# EAGLE design LM94022TmpBoard (EAGLE 6.5.0)
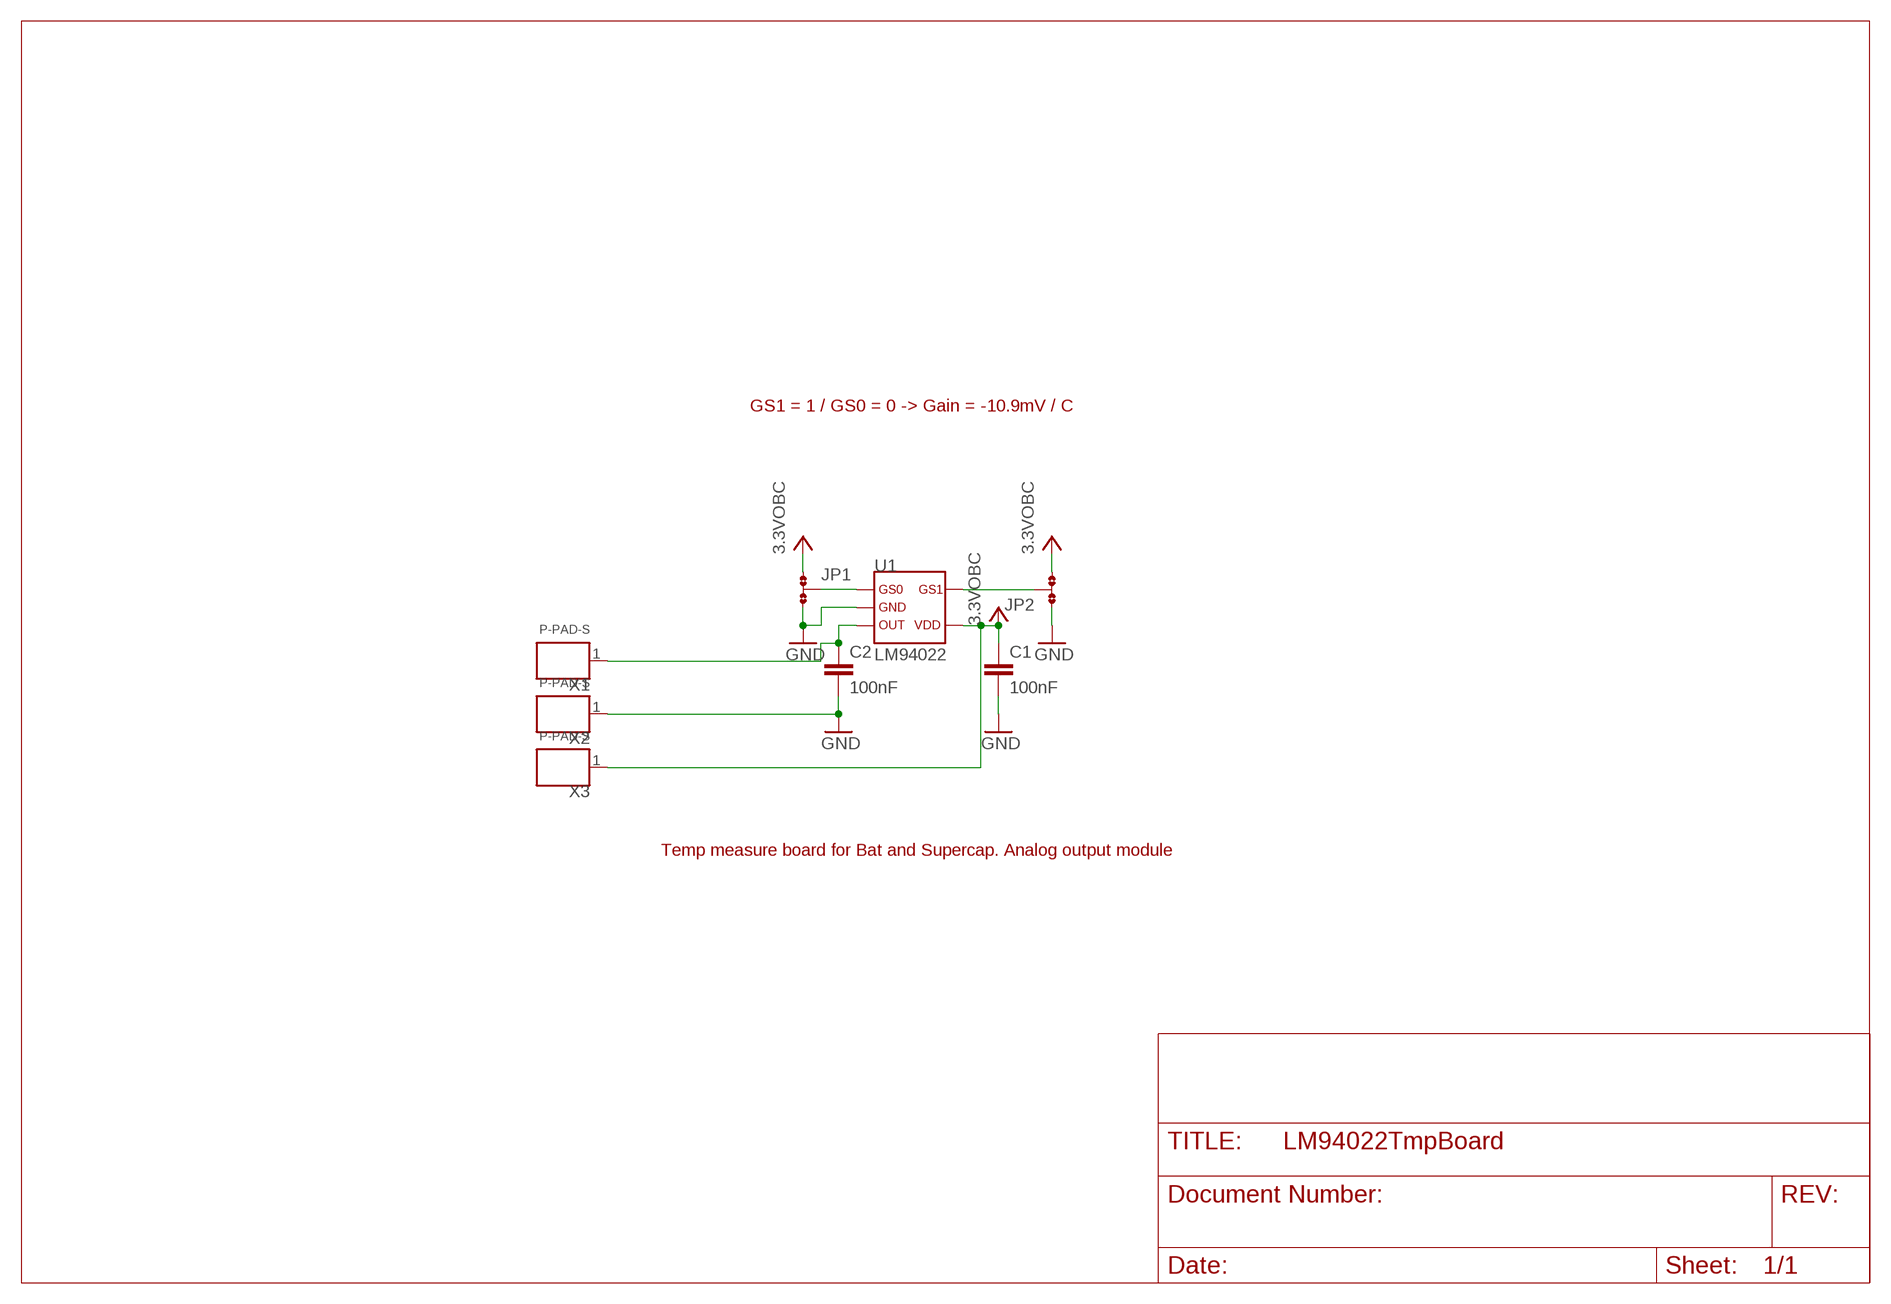
[diagram p0: schematic, sheet 1]

## Parts
C1  100nF  C0603(1608)  [C0603(1608)]
C2  100nF  C0603(1608)  [C0603(1608)]
JP1  JP2  [JP2SMD0603]
JP2  JP2  [JP2SMD0603]
U1  LM94022  [SC70-5]
X1  P-PAD-S  [P-PAD-S]
X2  P-PAD-S  [P-PAD-S]
X3  P-PAD-S  [P-PAD-S]

## Nets
3.3VOBC: C1.1 JP1.1 JP2.3 U1.P$4 X3.1
GND: C1.2 C2.2 JP1.3 JP2.1 U1.P$2 X2.1
N$1: JP1.2 U1.P$1
N$2: JP2.2 U1.P$5
N$3: C2.1 U1.P$3 X1.1

## Notes on the sheet
- GS1 = 1 / GS0 = 0 -> Gain = -10.9mV / C
- Temp measure board for Bat and Supercap. Analog output module

## Library data of the parts
C1 C2 = OSSI:C
JP1 JP2 = OSSI:JP2
U1 = OSSI:LM94022: LM94022 Temp Sensor From TI
X1-X3 = OSSI:P-PAD

## Board
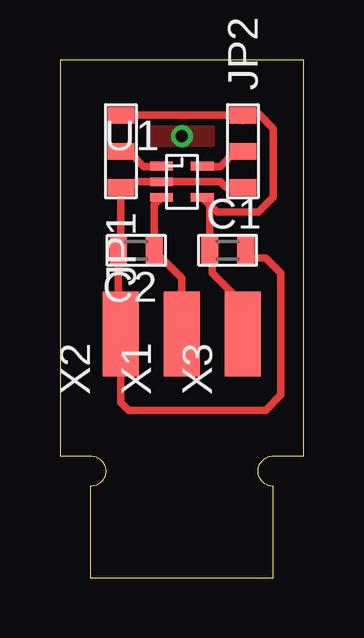
[diagram p1: board, top side]
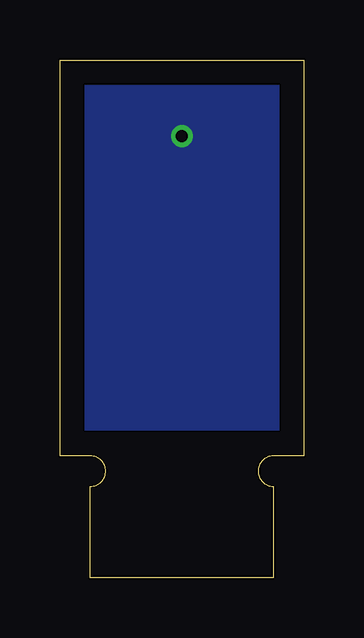
[diagram p2: board, bottom side, seen from below]

Size 10.16 x 21.59 mm. Coordinates in mm from the lower left corner, seen from the top.
Outline: 1.27,0 8.89,0 8.89,2.54 8.89,3.81 arc-180 8.89,5.08 10.16,5.08 10.16,21.59 0,21.59 0,6.35 0,5.08 1.27,5.08 arc-180 1.27,3.81 1.27,2.54 1.27,0
Copper layers (1*16): Top 0.035mm / dielectric 1.5mm / Bottom 0.035mm
Design rules: minimum track width 10mil, minimum drill 24mil, track to track 8mil, track to pad 8mil, pad to pad 8mil, via to via 8mil, smd to smd 8mil, copper to edge 40mil, drill to drill 8mil, minimum pad ring 10mil, minimum via ring 8mil, stop-mask expansion 4mil, vias tented up to drill 0mil, thermal gap 10mil

### Footprints (pad centres in the part's own frame; a part is rotated, then mirrored left to right if it is on the bottom)
C0603(1608) = smd 0.7 x 1.1: 1 -0.75,0; 2 0.75,0
JP2SMD0603 = smd 0.7 x 1.1: 1 -1.5,0; 2 0,0; 3 1.5,0
SC70-5 = smd 0.36 x 0.95: P$1 -0.65,-0.85; P$2 0,-0.85; P$3 0.65,-0.85; P$4 0.65,0.85; P$5 -0.65,0.85
P-PAD-S = smd 3.556 x 1.5: 1 0,0

### Placement (x,y rotation side)
C1  6.99,13.65 0 top
C2  3.17,13.65 180 top
JP1  2.54,17.78 270 top
JP2  7.62,17.78 90 top
U1  5.08,16.51 270 top
X1  5.08,10.16 90 top
X2  2.54,10.16 90 top
X3  7.62,10.16 90 top

### Tracks (layer width: path | path; a pad name or v marks a point on that pad's centre or on a via)
3.3VOBC
  Top 0.305: X3.1 7.62,11.43 6.35,12.7 6.35,13.54 C1.1 6.24,15.55 U1.P$4 6.55,15.24 8.26,15.24 8.89,15.88 8.89,18.73 8.26,19.37 7.62,19.37 JP2.3 | JP2.3 7.62,19.05 JP2.3 | JP1.1 JP2.3
GND
  Top 0.305: JP2.1 6.9,16.28 6.67,16.51 U1.P$2 3.17,16.51 2.94,16.28 JP1.3 2.54,13.77 C2.2 2.42,10.28 X2.1 2.54,7.3 2.86,6.99 8.57,6.99 9.21,7.62 9.21,12.7 8.57,13.34 8.05,13.34 C1.2
N$1
  Top 0.305: U1.P$1 4.21,17.14 3.49,17.14 2.86,17.78 JP1.2
N$2
  Top 0.305: U1.P$5 5.95,17.14 6.67,17.14 7.3,17.78 JP2.2
N$3
  Top 0.305: U1.P$3 3.92,15.55 C2.1 5.08,12.5 X1.1
THERMAL  (via drill 0.5)
  other vias: 5.08,18.41
  pour Bottom (no thermals): 0,21.59 10.16,21.59 10.16,6.35 0,6.35
  pour Top (no thermals): 3.81,18.73 3.81,18.1 6.35,18.1 6.35,18.73

### Text on the board
Document: GND | TEMP | 3.3V